# EAGLE design CircuitPlayground-BLE-V1 (EAGLE 9.3.2)
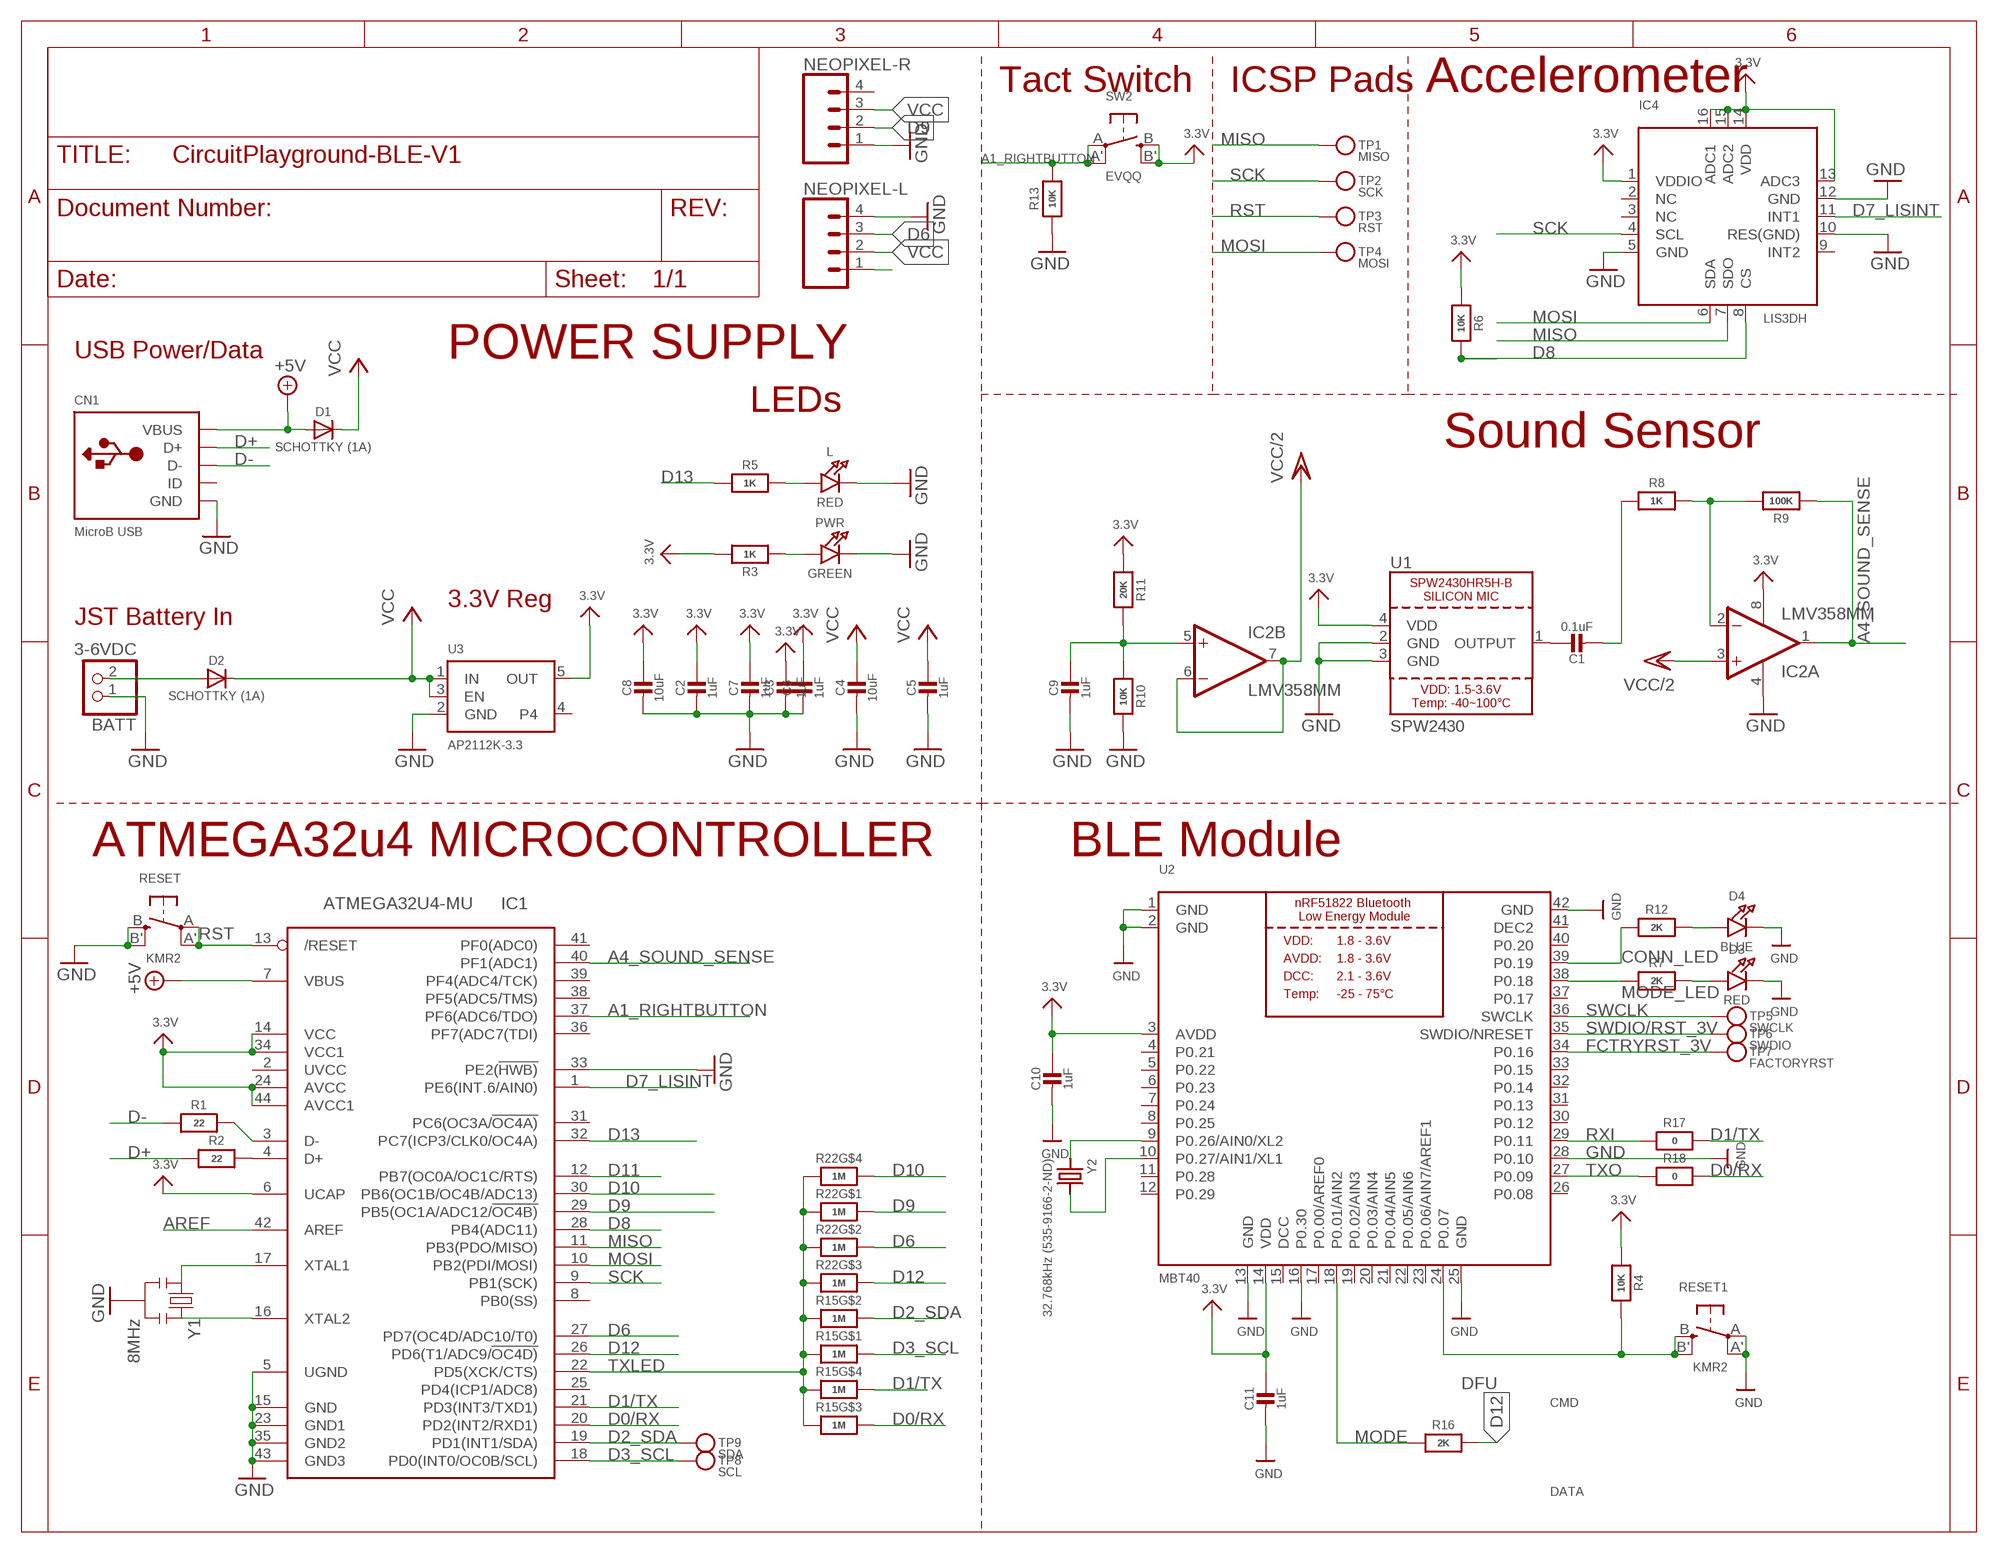
[diagram p0: schematic, sheet 1]

## Parts
BATT  3-6VDC  CON_JST_PH_2PIN  [JSTPH2]
C1  0.1uF  CAP_CERAMIC0603_NO  [0603-NO]
C2  1uF  CAP_CERAMIC0603_NO  [0603-NO]
C3  1uF  CAP_CERAMIC0603_NO  [0603-NO]
C4  10uF  CAP_CERAMIC0805-NOOUTLINE  [0805-NO]
C5  1uF  CAP_CERAMIC0603_NO  [0603-NO]
C6  1uF  CAP_CERAMIC0603_NO  [0603-NO]
C7  1uF  CAP_CERAMIC0603_NO  [0603-NO]
C8  10uF  CAP_CERAMIC0805-NOOUTLINE  [0805-NO]
C9  1uF  CAP_CERAMIC0603_NO  [0603-NO]
C10  1uF  CAP_CERAMIC0805-NOOUTLINE  [0805-NO]
C11  1uF  CAP_CERAMIC0805-NOOUTLINE  [0805-NO]
CN1  MicroB USB  USB_MICRO_20329_V2  [4UCONN_20329_V2]
D1  SCHOTTKY (1A)  DIODESOD-123  [SOD-123]
D2  SCHOTTKY (1A)  DIODESOD-123  [SOD-123]
D3  RED  LED0805_NOOUTLINE  [CHIPLED_0805_NOOUTLINE]
D4  BLUE  LED0805_NOOUTLINE  [CHIPLED_0805_NOOUTLINE]
IC1  ATMEGA32U4-MU  [TQFN44_7MM]
IC2  LMV358MM  [MSOP08]
IC4  LIS3DH  ACCEL_LIS3DHTR  [LGA16_3X3MM]
L  RED  LED0805_NOOUTLINE  [CHIPLED_0805_NOOUTLINE]
NEOPIXEL-L  CONN_04  [1X04]
NEOPIXEL-R  CONN_04  [1X04]
PWR  GREEN  LED0805_NOOUTLINE  [CHIPLED_0805_NOOUTLINE]
R1  22  RESISTOR_0603_NOOUT  [0603-NO]
R2  22  RESISTOR_0603_NOOUT  [0603-NO]
R3  1K  RESISTOR_0603_NOOUT  [0603-NO]
R4  10K  RESISTOR0805_NOOUTLINE  [0805-NO]
R5  1K  RESISTOR_0603_NOOUT  [0603-NO]
R6  10K  RESISTOR_0603_NOOUT  [0603-NO]
R7  2K  RESISTOR0805_NOOUTLINE  [0805-NO]
R8  1K  RESISTOR_0603_NOOUT  [0603-NO]
R9  100K  RESISTOR_0603_NOOUT  [0603-NO]
R10  10K  RESISTOR_0603_NOOUT  [0603-NO]
R11  20K  RESISTOR_0603_NOOUT  [0603-NO]
R12  2K  RESISTOR0805_NOOUTLINE  [0805-NO]
R13  10K  RESISTOR_0603_NOOUT  [0603-NO]
R15  1M  RESISTOR_4PACK_NO  [RESPACK_4X0603_NO]
R16  2K  RESISTOR0805_NOOUTLINE  [0805-NO]
R17  0  RESISTOR_0603_NOOUT  [0603-NO]
R18  0  RESISTOR_0603_NOOUT  [0603-NO]
R22  1M  RESISTOR_4PACK_NO  [RESPACK_4X0603_NO]
RESET  KMR2  SWITCH_TACT_SMT4.6X2.8  [BTN_KMR2_4.6X2.8]
RESET1  KMR2  SWITCH_TACT_SMT4.6X2.8  [BTN_KMR2_4.6X2.8]
SW2  EVQQ  SWITCH_TACT_SMT_EVQQ2_SMALL  [EVQ-Q2_SMALLER]
TP1  MISO  TESTPOINTROUND1.5MM  [TESTPOINT_ROUND_1.5MM]
TP2  SCK  TESTPOINTROUND1.5MM  [TESTPOINT_ROUND_1.5MM]
TP3  RST  TESTPOINTROUND1.5MM  [TESTPOINT_ROUND_1.5MM]
TP4  MOSI  TESTPOINTROUND1.5MM  [TESTPOINT_ROUND_1.5MM]
TP5  SWCLK  TESTPOINTROUND1.5MM  [TESTPOINT_ROUND_1.5MM]
TP6  SWDIO  TESTPOINTROUND1.5MM  [TESTPOINT_ROUND_1.5MM]
TP7  FACTORYRST  TESTPOINTROUND1.5MM  [TESTPOINT_ROUND_1.5MM]
TP8  SCL  TESTPOINTROUND1.5MM  [TESTPOINT_ROUND_1.5MM]
TP9  SDA  TESTPOINTROUND1.5MM  [TESTPOINT_ROUND_1.5MM]
U1  SPW2430  SPW2430HR5H-B  [SPW2430HR5H-B]
U2  MBT40  NRF51822_MODULE_MDBT40  [BLE_MODULE_RAYTAC_MDBT40]
U3  AP2112K-3.3  VREG_SOT23-5  [SOT23-5]
Y1  8MHz  RESONATORSMD  [RESONATOR-SMD]
Y2  32.768kHz (535-9166-2-ND)  CRYSTAL2.0X6.0_32.768  [CRYSTAL_CYL_2X6MM_SMT]

## Nets
3.3V: C2.1 C3.1 C6.1 C7.1 C8.1 C10.1 C11.1 IC1.6(UCAP) IC1.14(VCC) IC1.24(AVCC) IC1.34(VCC1) IC1.44(AVCC1) IC2.8(P:V+) IC4.1(VDDIO) IC4.13(ADC3) IC4.14(VDD) IC4.15(ADC2) IC4.16(ADC1) NEOPIXEL-L.1 R3.2 R4.1 R6.1 R11.1 SW2.B'(S1) SW2.B(S) U1.4(VDD) U2.3(AVDD) U2.14(VDD) U3.5(OUT)
+5V: CN1.VBUS D1.A IC1.7(VBUS)
A1_RIGHTBUTTON: IC1.37(PF6(ADC6/TDO)) R13.2 SW2.A'(P1) SW2.A(P)
A4_SOUND_SENSE: IC1.40(PF1(ADC1)) IC2.1(A:OUT) R9.1
AREF: IC1.42(AREF)
CONN_LED: R12.1 U2.39(P0.19)
D0/RX: IC1.20(PD2(INT2/RXD1)) R15.6 R18.2
D1/TX: IC1.21(PD3(INT3/TXD1)) R15.5 R17.2
D2_SDA: IC1.19(PD1(INT1/SDA)) R15.7 TP9.P$1
D3_SCL: IC1.18(PD0(INT0/OC0B/SCL)) R15.8 TP8.P$1
D6: IC1.27(PD7(OC4D/ADC10/T0)) NEOPIXEL-L.3 R22.7
D7_LISINT: IC1.1(PE6(INT.6/AIN0)) IC4.11(INT1)
D8: IC1.28(PB4(ADC11)) IC4.8(CS) R6.2
D9: IC1.29(PB5(OC1A/ADC12/!OC4B)) NEOPIXEL-R.2 R22.8
D10: IC1.30(PB6(OC1B/OC4B/ADC13)) R22.5
D11: IC1.12(PB7(OC0A/OC1C/RTS))
D12: IC1.26(PD6(T1/ADC9/!OC4D)) R16.2 R22.6
D13: IC1.32(PC7(ICP3/CLK0/OC4A)) R5.1
D+: CN1.D+ R2.1
D-: CN1.D- R1.1
DFU: R4.2 RESET1.B'(S1) RESET1.B(S) U2.24(P0.07)
FCTRYRST_3V: TP7.P$1 U2.34(P0.16)
GND: BATT.1 C2.2 C3.2 C4.2 C5.2 C6.2 C7.2 C8.2 C9.2 C10.2 C11.2 CN1.BASE@1(GND) CN1.BASE@2(GND) CN1.GND CN1.SPRT@1(GND) CN1.SPRT@2(GND) CN1.SPRT@3(GND) CN1.SPRT@4(GND) D3.C D4.C IC1.5(UGND) IC1.15(GND) IC1.23(GND1) IC1.33(PE2(!HWB)) IC1.35(GND2) IC1.43(GND3) IC2.4(P:V-) IC4.5(GND) IC4.10(RES(GND)) IC4.12(GND) L.C NEOPIXEL-L.4 NEOPIXEL-R.1 PWR.C R10.2 R13.1 RESET1.A'(P1) RESET1.A(P) RESET.B'(S1) RESET.B(S) U1.2(GND) U1.3(GND) U2.1(GND) U2.2(GND) U2.13(GND) U2.16(P0.30) U2.25(GND) U2.28(P0.10) U2.42(GND) U3.2(GND) Y1.2
MISO: IC1.11(PB3(PDO/MISO)) IC4.7(SDO) TP1.P$1
MODE: R16.1 U2.18(P0.01/AIN2)
MODE_LED: R7.1 U2.38(P0.18)
MOSI: IC1.10(PB2(PDI/MOSI)) IC4.6(SDA) TP4.P$1
N$1: PWR.A R3.1
N$2: IC2.2(A:-IN) R8.2 R9.2
N$3: IC1.3(D-) R1.2
N$4: IC1.4(D+) R2.2
N$5: D3.A R7.2
N$6: C9.1 IC2.5(B:+IN) R10.1 R11.2
N$7: BATT.2 D2.A
N$8: IC1.17(XTAL1) Y1.1
N$9: IC1.16(XTAL2) Y1.3
N$10: L.A R5.2
N$11: D4.A R12.2
N$12: U2.9(P0.26/AIN0/XL2) Y2.1
N$13: U2.10(P0.27/AIN1/XL1) Y2.2
N$15: C1.2 R8.1
RST: IC1.13(/RESET) RESET.A'(P1) RESET.A(P) TP3.P$1
RXI: R17.1 U2.29(P0.11)
SCK: IC1.9(PB1(SCK)) IC4.4(SCL) TP2.P$1
SOUNDOUT: C1.1 U1.1(OUTPUT)
SWCLK: TP5.P$1 U2.36(SWCLK)
SWDIO/RST_3V: TP6.P$1 U2.35(SWDIO/NRESET)
TXLED: IC1.22(PD5(XCK/CTS)) R15.1 R15.2 R15.3 R15.4 R22.1 R22.2 R22.3 R22.4
TXO: R18.1 U2.27(P0.09)
VCC: C4.1 C5.1 D1.C D2.C NEOPIXEL-L.2 NEOPIXEL-R.3 U3.1(IN) U3.3(EN)
VCC/2: IC2.3(A:+IN) IC2.6(B:-IN) IC2.7(B:OUT)
Unconnected: CN1.ID IC1.2(UVCC) IC1.8(PB0(SS)) IC1.25(PD4(ICP1/ADC8)) IC1.31(PC6(OC3A/!OC4A)) IC1.36(PF7(ADC7(TDI)) IC1.38(PF5(ADC5/TMS)) IC1.39(PF4(ADC4/TCK)) IC1.41(PF0(ADC0)) IC4.2(NC) IC4.3(NC) IC4.9(INT2) NEOPIXEL-R.4 U2.4(P0.21) U2.5(P0.22) U2.6(P0.23) U2.7(P0.24) U2.8(P0.25) U2.11(P0.28) U2.12(P0.29) U2.17(P0.00/AREF0) U2.19(P0.02/AIN3) U2.20(P0.03/AIN4) U2.21(P0.04/AIN5) U2.22(P0.05/AIN6) U2.23(P0.06/AIN7/AREF1) U2.26(P0.08) U2.30(P0.12) U2.31(P0.13) U2.32(P0.14) U2.33(P0.15) U2.37(P0.17) U2.40(P0.20) U3.4

## Notes on the sheet
- Tact Switch | ICSP Pads | Accelerometer
- USB Power/Data | POWER SUPPLY
- LEDs
- Sound Sensor
- 3.3V Reg
- JST Battery In
- ATMEGA32u4 MICROCONTROLLER | BLE Module
- CMD
- DATA

## Power pins joined to a net without a drawn wire
DCC: U2.15(DCC)
DEC2: U2.41(DEC2)

## Library data of the parts
BATT = microbuilder:CON_JST_PH_2PIN: JST 2-Pin Right-Angle Connector PH-Series - 4UConnector: 17311 SH-Series - 4UConnector: 07278
C1-C11 = microbuilder:CAP_CERAMIC: Ceramic Capacitors For new designs, use the packages preceded by an '_' character since they are more reliable: The following footprints should be used on most boards: _0402 - Standard footprint for regular board layouts _0603 - Standard footprint for regular board layouts _0805 - Standard footprint for regular board layouts _1206 - Standard footprint for regular board layouts For extremely tight-pitch boards where space is at a premium, the following 'micro-pitch' footprints can be used (smaller pads, no silkscreen outline, etc.): _0402MP - Micro-pitch footprint for very dense/compact boards _0603MP - Micro-pitch footprint for very dense/compact boards _0805MP - Micro-pitch footprint for very dense/compact boards _1206MP - Micro-pitch footprint for very dense/compact boards
CN1 = microbuilder:USB: USB Connectors USBMINIB - Surface Mount Female Mini-B USB Connector 4UConnector: 06564
D1 D2 = microbuilder:DIODE: Diode SMA Model Volts Amps Type Vf Ir Digikey # Notes SSA34-E3 40V 3A Schottky 480mV @ 3A 200uA @ 40V SSA34-E3/61TGITR-ND CDBA120-G 20V 1A Schottky 500mV @ 1A 500uA @ 20V 641-1014-6-ND REEL MBRA210 10V 2A Schottky 350mV @ 2A 700uA @ 10V MBRA210LT3 SOD-123 Model Volts Amps Type Vf Ir Order # Notes BAT54T1G 30V 200mA Schottky 800mV @ 200mA 2uA @ 25V BAT54T1GOSTR-ND B0530W 30V 500mA Schottky 430mV @ 500mA 130uA @ 30V B0530W-FDICT-ND REEL MBR120 20V 1A Schottky 340mV @ 1A MBR120VLSFT1GOSCT-ND SOD-323 Model Volts Amps Type Vf Ir Order # Notes PMEG2005EJ 20V 500mA Schottky 355mV @ 500mA 568-4110-1-ND ZLLS410 10V 570mA Schottky 380mV @ 570mA ZLLS410CT-ND 1N4148WS 75V 150mA Silicon/Simple 1V 1N4148WSFSCT-ND REEL SOD-523 Model Volts Amps Type Vf Ir Order # Notes BAT54XV2 30V 200mA Schottky 0.8V @ 100mA BAT54XV2CT-ND TB751S 30V 30mA Schottky RB751S-40TE61CT-ND SOT23-R/W (R = Solder Paste/Reflow Ovens, W = Hand-Soldering) Model Volts Amps Type Vf Ir Order # Notes BAT54FILM 40V 300mA Schottky 497-7162-1-ND POWERDI-5 Model Volts Amps Type Vf Ir Order # Notes PDS560 60V 5A Schottky 670mV @ 5A 150uA @ 60V PDS560DICT-ND
D3 D4 L PWR = microbuilder:LED: LED 0603 - 0603 Surface Mount Package 2mA: Green LED - Low Power (3.9mcd, 2ma, 1.7Vf) - Digikey: 475-2709-2-ND Orange LED - Low Power (9.8mcd, 2ma, 1.8Vf) - Digikey: 475-1194-2-ND Red LED - Low Power (5mcd, 2ma, 1.8Vf) - Digikey: 475-1195-2-ND Yellow LED - Low Power (7mcd, 2ma, 1.8Vf) - Digikey: 475-1196-2-ND 5mA: Blue LED - Low Power (17mcd, 5ma, 2.9Vf) - Digikey: LNJ937W8CRACT-ND 0805 - 0805 Surface Mount Package 2mA: Red LED (8.8mcd, 2mA, 1.8Vf, Clear) - Low Power [Digikey: 475-2510-1-ND] Green LED (5mcd, 2mA, 1.8Vf, Clear) - Low Power [Digikey: 475-2730-1-ND] Yellow LED (11.3mcd, 2mA, 1.8Vf, Clear) - Low Power [Digikey: 475-2555-1-ND] 20mA: Red LED (104mcd, 20mA, Diffused) - LS R976 [Digikey: 475-1278-6-ND] Red LED (12mcd, 20mA, 2.0Vf, Clear) - APT2012EC [Digikey: 754-1128-1-ND] Green LED (15mcd, 20mA, 2.2Vf, Clear) - APT2012GC [Digikey: 754-1131-1-ND] Orange LED (160mcd, 20mA, 2.1Vf, Clear) - APT2012SECK [Digikey: 754-1130-1-ND] 1206 - 1206 Surface Mount Package Green LED (26mcd, 20mA, Diffused) - LG N971 [Digikey: 475-1407-6-ND] Red LED (15mcd, 20mA, Diffused) - LH N974 [Digikey: 475-1416-6-ND] Cree - Cree High-Power Surface Mount LEDs XPEBWT-L1-0000-00D50 - White 111lm 350mA 2.9Vf 6200K 110° XTEAWT-00-0000-00000LEE3 - White 114lm 350mA 2.85Vf 5000K 115° Everlight - Everlight 45-21 Series Surface Mount LEDs 45-21/QK2C-B2832AC2CB2/2T - Warm White 2000mcd 20mA 3.25Vf 3050K 120° 45-21/LK2C-B38452C4CB2/2T - Nuetral White 2000mcd 20mA 3.25Vf 4150K 120° 45-21/LK2C-B50634C6CB2/2T - Cold White 2200mcd 20mA 3.25Vf 5650K 120° PLCC2 Reverse Mount LS T77K-J1L2-1-0-2-R18-Z - Red 11.25mcd 2mA 1.8Vf 630nm 120° LO T77K-L1M2-24-Z - Orange 19.6mcd 2mA 1.8Vf 606nm 120° LY T77K-K2M1-26-Z - Yellow 15.7mcd 2mA 1.8Vf 587nm 120°
IC1 = microbuilder:ATMEGA32U4: http://www.ladyada.net/library/eagle
IC2 = linear:LMV358?*: Dual General Purpose, Low Voltage, Rail-to-Rail Output Operational Amplifiers Source: http://www.national.com/mpf/LM/LMV321.html http://www.national.com/dt/lmv_qual.pdf
IC4 = microbuilder:ACCEL_LIS3DHTR: LIS3DHTR 3-Axis Accelerometer with I2C/SPI Interface VDD: 1.71-3.6V VDDIO: 1.71-VDD+0.1V Scale: +/-2g, 4g, 8g, 16g with 16--bit data output Temp:: -40°C - 85°C Mouser: 511-LIS3DHTR Digikey: 497-10613-1-ND
NEOPIXEL-L NEOPIXEL-R = SparkFun-Connectors:CONN_04: Multi connection point. Often used as Generic Header-pin footprint for 0.1 inch spaced/style header connections On any of the 0.1 inch spaced packages, you can populate with these: Break Away Headers - Straight <https://www.sparkfun.com/products/116> (PRT-00116) Break Away Male Headers - Right Angle <https://www.sparkfun.com/products/553> (PRT-00553) Female Headers <https://www.sparkfun.com/products/115> (PRT-00115) Break Away Headers - Machine Pin <https://www.sparkfun.com/products/117> (PRT-00117) Break Away Female Headers - Swiss Machine Pin <https://www.sparkfun.com/products/743> (PRT-00743) For SCREWTERMINALS and SPRING TERMINALS visit here: Screw Terimnals on SparkFun.com <https://www.sparkfun.com/search/results?term=Screw+Terminals> (5mm/3.5mm/2.54mm spacing) This device is also useful as a general connection point to wire up your design to another part of your project. Our various solder wires solder well into these plated through hole pads. Hook-Up Wire - Assortment (Stranded, 22 AWG) <https://www.sparkfun.com/products/11375> (PRT-11375) Hook-Up Wire - Assortment (Solid Core, 22 AWG) <https://www.sparkfun.com/products/11367> (PRT-11367) View the entire wire category on our website here <https://www.sparkfun.com/categories/141> Special notes: Molex polarized connector foot print use with SKU : PRT-08231 with associated crimp pins and housings. 1MM SMD Version SKU: PRT-10208; PROD_ID: CONN-09696
R1-R13 R16-R18 = microbuilder:RESISTOR: Resistors For new designs, use the packages preceded by an '_' character since they are more reliable: The following footprints should be used on most boards: _0402 - Standard footprint for regular board layouts _0603 - Standard footprint for regular board layouts _0805 - Standard footprint for regular board layouts _1206 - Standard footprint for regular board layouts For extremely tight-pitch boards where space is at a premium, the following 'micro-pitch' footprints can be used (smaller pads, no silkscreen outline, etc.): _0402MP - Micro-pitch footprint for very dense/compact boards _0603MP - Micro-pitch footprint for very dense/compact boards _0805MP - Micro-pitch footprint for very dense/compact boards _1206MP - Micro-pitch footprint for very dense/compact boards
R15 R22 = microbuilder:RESISTOR_4PACK: Resistor Packs (4 resistors) 4 x 0603 10K 1/16W - Digikey: YC164J-10KCT-ND
RESET RESET1 SW2 = microbuilder:SWITCH_TACT_SMT: SMT Tact Switches 6x6mm - Digikey: P12940SCT-ND KMR2 (4.6x2.8mm) - Digikey: 401-1426-1-ND EVQ-PQHB55 - Light Touch, 160GF (4.5x4.5mm) - Digikey: P8090SCT-ND KMT0 - KMT021 NGJ LHS (etc.) IP68/Waterproof - Digikey: CKN10289CT-ND
TP1-TP9 = microbuilder:TESTPOINT: Test Point Various test points for characterisation and PCB testing TESTPOINT_SMT - Compact Surface Mount Test Point [Digikey: 5016KTR-ND]
U1 = microbuilder:SPW2430HR5H-B: SPW2430HR5H-B - Silicon Microphone
U2 = microbuilder:NRF51822_MODULE_MDBT40: nRF51822 Bluetooth Low Energy Module
U3 = microbuilder:VREG_SOT23-5: SOT23-5 Fixed Voltage Regulators Part Current Out V Out V In V Dropout θJA (°C/W) TJ (°C) Digikey Part No. ADP121 150mA 3.3V 3.4-5.5V 0.09V @ 150mA -- -- ADP121-AUJZ33R7CT-ND ADP121 150mA 3.0V 3.1-5.5V 0.09V @ 150mA -- -- ADP121-AUJZ30R7CT-ND ADP122 300mA 3.3V 3.4-5.5V 0.085V @ 300mA -- -- ADP122AUJZ-3.3-R7CT-ND ADP1712 300mA 3.3V 3.5-5.5V 0.17V @ 300mA -- -- ADP1712AUJZ-3.3-R7TR-ND AP7311 (Low Cost) 150mA 3.3V 3.5-6V 0.15V @ 150mA -- -- AP7311-33WG-7DICT-ND LD39015M18R 150mA 1.8V 1.9V-5.5V 0.08V @ 100mA -- -- 497-6977-1-ND LP2985A-33DBVR 150mA 3.3V 3.3-16V 0.28V @ 150mA 206 150 296-18479-1-ND MCP1824T-3302E/OT 300mA 3.3V 3.5V-6V 0.2V @ 300mA -- -- MCP1824T-3302E/OTCT-ND MIC5205-2.5YM5 TR 150mA 2.5V 2.7-16V 0.165V @ 150mA -- -- 576-1257-2-ND MIC5205-3.0YM5 TR 150mA 3.0V 3.2V-16V 0.165V @ 150mA -- -- 576-1258-2-ND MIC5205-3.3YM5 TR 150mA 3.3V 3.5V-16V 0.165V @ 150mA -- -- 576-1259-2-ND TPS780330220 150mA 3.3V+2.2V 3.6-5.5V 250mV Max -- -- 296-23332-1-ND TDA3663/N1,135 100mA 3.3V 3.5-45V 0.18V @ 50mA -- -- 568-5343-1-ND Max operating temp can be calculated using θJA, TJ (max junction temperature), and power in watts. Set the "Maximum Ambient Temperature" until it reaches TJ ("Max Junction Temperature"), which is the absolute limit for safe use of the regulator: Heat Sink Temperature Calculator <http://www.daycounter.com/Calculators/Heat-Sink-Temperature-Calculator.phtml> For example, With 12V source into a 3.3V LP2985 and a 30mA load, we are dissipating (12V-3.3V) * 0.03A = 0.261W. With a θJA of 206 °C/W, a TJ of 150°C, and 261mW we can safely use the chip without a heat sink up to 75°C (=147.1°C Junction Temperature).
Y1 = SparkFun:RESONATOR: Resonator Small SMD resonator. This is the itty bitty 10/20MHz resonators with built in caps. CSTCE10M0G55 and CSTCE20M0V53. Footprint has been reviewed closely but hasn't been tested yet.
Y2 = microbuilder:CRYSTAL: Crystals HC49UP - Surface Mount Crystal 4.0MHz 18pF +/-30ppm Surface Mount Crystal [Digikey: 535-9857-1-ND] 12.0 MHz Surface Mount Crystal [Digikey: 535-9869-6-ND] 25.0 MHz Surface Mount Crystal [Digikey: 535-9078-1-ND] 2.5 x 2.0mm - MEMs SMT Crystal 16.0 MHz 10pF 20ppm 2.5 x 2.0mm Crystal [Digikey -40-85°C: 535-10923-1-ND] 3.2 x 2.5mm - MEMs SMT Crystal 12.0 MHz 8pF 15ppm 3.2 x 2.5mm Crystal [Digikey: -10-70°C: 644-1047-1-ND -40-125°C: 644-1128-1-ND] 40~85°C cheaper: 644-1173-6-ND 16.0 MHz 8pF 15ppm 3.2 x 2.5mm Crystal [Digikey: -10-70°C: 644-1049-1-ND -40-125°C: 644-1129-2-ND]-40~85°C cheaper: 644-1175-6-ND 16.0 MHz 10pF 10ppm 3.2 x 2.5mm Crystal [Digikey: 644-1100-1-ND] 27.12 MHz 18pF 30ppm 3.2 x 2.5mm Crystal [Digikey: 887-1424-1-ND] 27.12MHz 10pF 10ppm 3.2 x 2.5mm Crystal [Digikey: 887-1329-1-ND] 4.9 x 1.8mm - MEMs SMT Crystal 32.768 KHz 12.5pF 20ppm 4.9 x 1.8mm Crystal [Digikey: SE2415CT-ND] 8.0 x 3.8mm - Surface Mount Crystal 32.768kHz 12.5pF 20ppm -40°C-85°C [Digikey: 535-9166-2-ND] Cylinder 32.768KHz Cylinder Crystal (2x6mm body) [Ex. Digikey: 300-8341-2-ND]

## Board
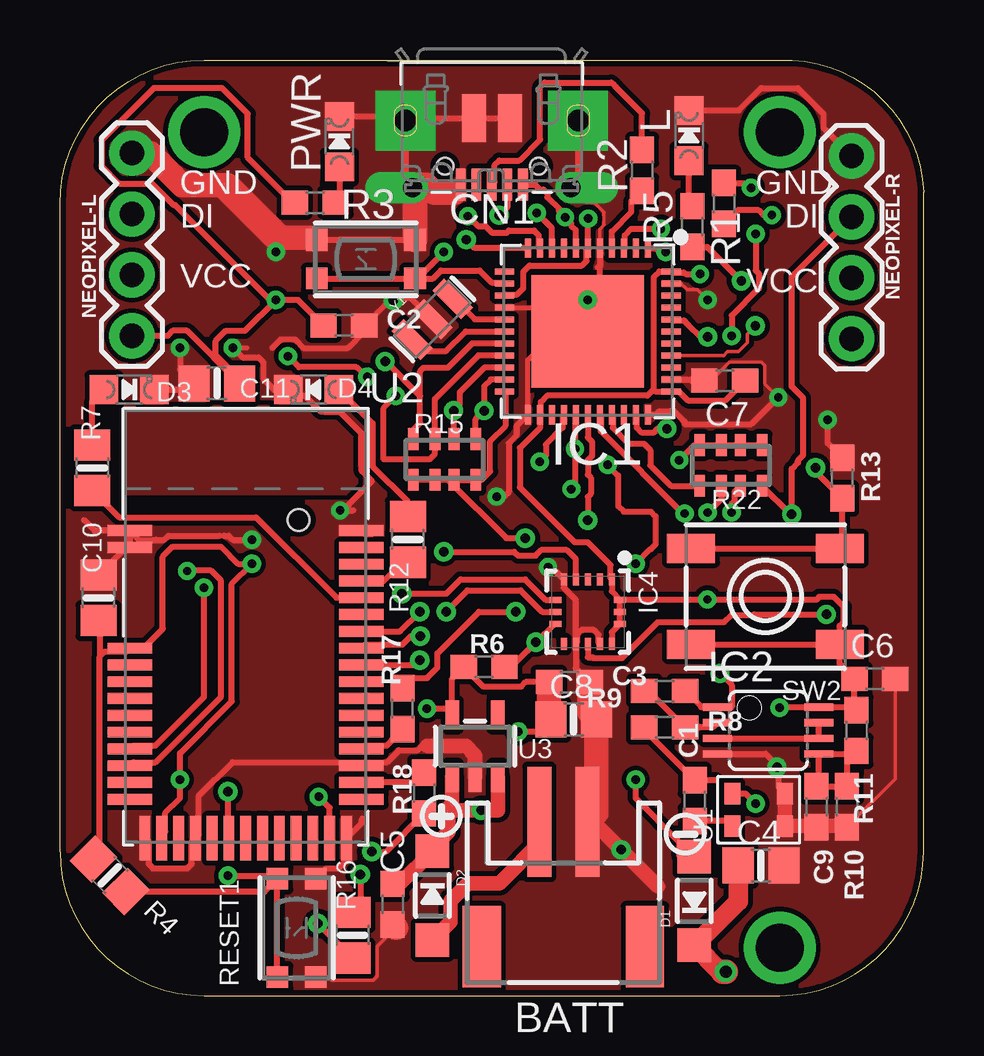
[diagram p1: board, top side]
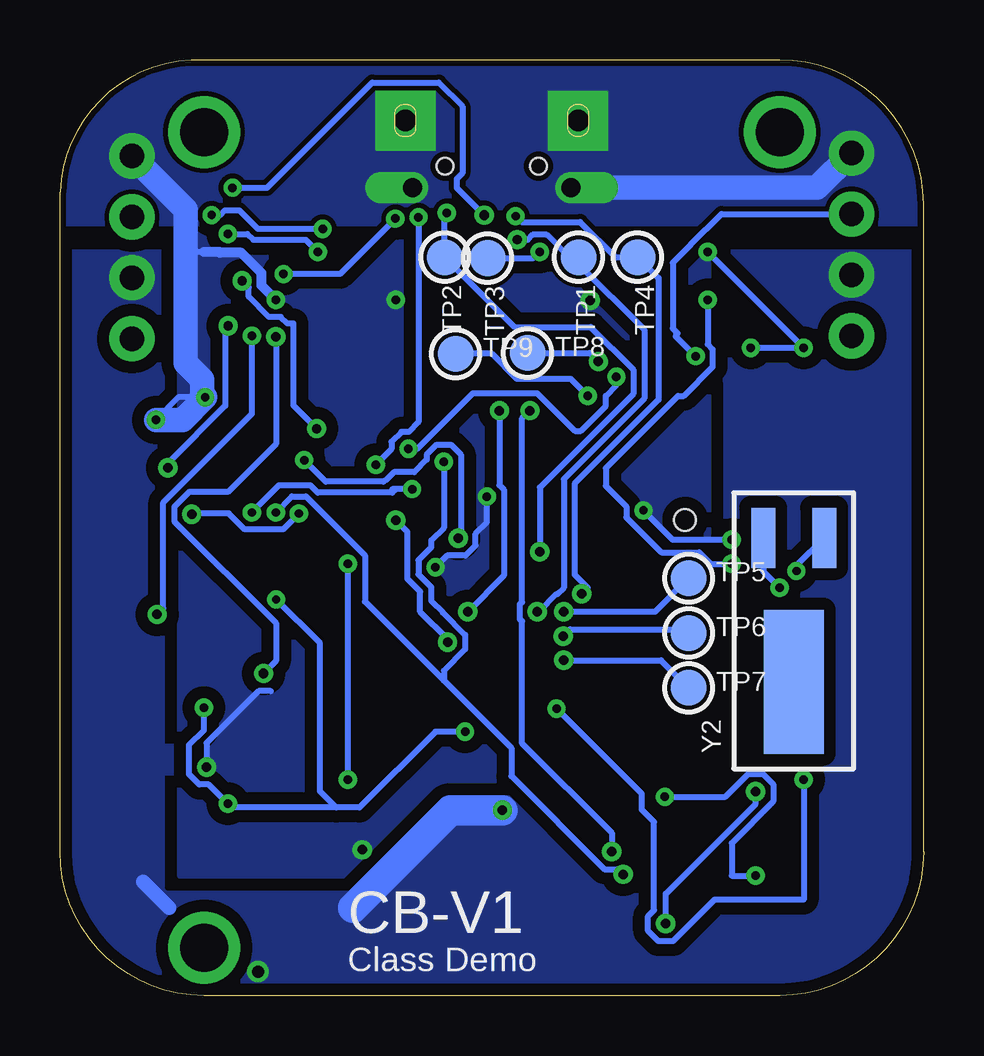
[diagram p2: board, bottom side, seen from below]

Size 36 x 39 mm. Coordinates in mm from the lower left corner, seen from the top.
Outline: 6,39 30,39 arc-90 36,33.5 36,6 arc-90 30,0 6,0 arc-90 0,6 0,33 arc-90 6,39
Copper layers (1*16): Top 0.035mm / dielectric 1.5mm / Bottom 0.035mm
Design rules "adafruit *": minimum track width 0.15mm, minimum drill 0.35mm, track to track 8mil, track to pad 8mil, pad to pad 8mil, via to via 8mil, smd to smd 8mil, copper to edge 10mil, drill to drill 8mil, minimum pad ring 10mil, minimum via ring 8mil, stop-mask expansion 2mil, vias tented up to drill 20mil, thermal gap 10mil

### Footprints (pad centres in the part's own frame; a part is rotated, then mirrored left to right if it is on the bottom)
JSTPH2 = smd 1 x 4.6: 1 -1,-3.7; 2 1,-3.7 | smd 1.6 x 3.4: NC1 -3.4,1.5; NC2 3.4,1.5
0603-NO = smd 1.1 x 1: 1 -0.85,0; 2 0.85,0
0805-NO = smd 1.3 x 1.5: 1 -0.95,0; 2 0.95,0
4UCONN_20329_V2 = smd 1 x 2: BASE@1 -0.75,-2; BASE@2 0.75,-2 | smd 0.4 x 1.35: D+ 0,0.775; D- -0.65,0.775; GND 1.3,0.775; ID 0.65,0.775; VBUS -1.3,0.775 | drill 0.8 pad 1.2 offset: SPRT@1 -3.3,0.9; SPRT@2 3.3,0.9 | drill 0.9 pad 2.5 square: SPRT@3 -3.6,-1.9; SPRT@4 3.6,-1.9 | hole 0.7: -1.95,0; 1.95,0
SOD-123 = smd 1.4 x 1.4: A 1.85,0; C -1.85,0
CHIPLED_0805_NOOUTLINE = smd 1.2 x 1.2: A 0,-1.05; C 0,1.05
TQFN44_7MM = smd 0.25 x 0.8: 1 -2.5,-3.475; 2 -2,-3.475; 3 -1.5,-3.475; 4 -1,-3.475; 5 -0.5,-3.475; 6 0,-3.475; 7 0.5,-3.475; 8 1,-3.475; 9 1.5,-3.475; 10 2,-3.475; 11 2.5,-3.475; 23 2.5,3.475; 24 2,3.475; 25 1.5,3.475; 26 1,3.475; 27 0.5,3.475; 28 0,3.475; 29 -0.5,3.475; 30 -1,3.475; 31 -1.5,3.475; 32 -2,3.475; 33 -2.5,3.475 | smd 0.8 x 0.25: 12 3.475,-2.5; 13 3.475,-2; 14 3.475,-1.5; 15 3.475,-1; 16 3.475,-0.5; 17 3.475,0; 18 3.475,0.5; 19 3.475,1; 20 3.475,1.5; 21 3.475,2; 22 3.475,2.5; 34 -3.475,2.5; 35 -3.475,2; 36 -3.475,1.5; 37 -3.475,1; 38 -3.475,0.5; 39 -3.475,0; 40 -3.475,-0.5; 41 -3.475,-1; 42 -3.475,-1.5; 43 -3.475,-2; 44 -3.475,-2.5 | smd 4.7 x 4.7: THERMAL 0,0
MSOP08 = smd 0.3 x 1.2: 1 -0.976,-2.113; 2 -0.326,-2.113; 3 0.324,-2.113; 4 0.974,-2.113; 5 0.974,2.112; 6 0.324,2.112; 7 -0.326,2.112; 8 -0.976,2.112
LGA16_3X3MM = smd 0.5 x 0.25: 1 -1.35,1; 2 -1.35,0.5; 3 -1.35,0; 4 -1.35,-0.5; 5 -1.35,-1; 9 1.35,-1; 10 1.35,-0.5; 11 1.35,0; 12 1.35,0.5; 13 1.35,1 | smd 0.25 x 0.5: 6 -0.5,-1.35; 7 0,-1.35; 8 0.5,-1.35; 14 0.5,1.35; 15 0,1.35; 16 -0.5,1.35
1X04 = drill 1.016 pad 1.88: 1 0,0; 2 2.54,0; 3 5.08,0; 4 7.62,0
RESPACK_4X0603_NO = smd 0.45 x 0.9: 1 -1.3,-0.85; 2 -0.4,-0.85; 3 0.4,-0.85; 4 1.3,-0.85; 5 1.3,0.85; 6 0.4,0.85; 7 -0.4,0.85; 8 -1.3,0.85
BTN_KMR2_4.6X2.8 = smd 0.9 x 0.9: A 2.05,0.8; A' -2.05,0.8; B 2.05,-0.8; B' -2.05,-0.8
EVQ-Q2_SMALLER = smd 2 x 1.2: A -3.1,-2; A' 3.1,-2; B -3.1,2; B' 3.1,2
TESTPOINT_ROUND_1.5MM = smd 1.5 x 1.5: P$1 0,0
SPW2430HR5H-B = smd 0.9 x 0.66: 1 -0.675,1.095; 2 -0.675,-1.095; 3 0.675,-1.095; 4 0.675,1.095
BLE_MODULE_RAYTAC_MDBT40 = smd 1.85 x 0.45: 1 -4.825,4; 2 -4.825,3.3; 3 -4.825,-0.9; 4 -4.825,-1.6; 5 -4.825,-2.3; 6 -4.825,-3; 7 -4.825,-3.7; 8 -4.825,-4.4; 9 -4.825,-5.1; 10 -4.825,-5.8; 11 -4.825,-6.5; 12 -4.825,-7.2; 26 4.825,-7.2; 27 4.825,-6.5; 28 4.825,-5.8; 29 4.825,-5.1; 30 4.825,-4.4; 31 4.825,-3.7; 32 4.825,-3; 33 4.825,-2.3; 34 4.825,-1.6; 35 4.825,-0.9; 36 4.825,-0.2; 37 4.825,0.5; 38 4.825,1.2; 39 4.825,1.9; 40 4.825,2.6; 41 4.825,3.3; 42 4.825,4 | smd 0.45 x 1.85: 13 -4.2,-8.825; 14 -3.5,-8.825; 15 -2.8,-8.825; 16 -2.1,-8.825; 17 -1.4,-8.825; 18 -0.7,-8.825; 19 0,-8.825; 20 0.7,-8.825; 21 1.4,-8.825; 22 2.1,-8.825; 23 2.8,-8.825; 24 3.5,-8.825; 25 4.2,-8.825 | hole 0.9: 2.2,4.45
SOT23-5 = smd 0.55 x 1.2: 1 -0.95,-1.3; 2 0,-1.3; 3 0.95,-1.3; 4 0.95,1.3; 5 -0.95,1.3
RESONATOR-SMD = smd 0.7 x 1.7: 1 -1.2,0; 2 0,0; 3 1.2,0
CRYSTAL_CYL_2X6MM_SMT = smd 2.5 x 1: 1 2.125,1.27; 2 2.125,-1.27 | smd 6 x 2.5: CYLINDER -3.875,0

### Placement (x,y rotation side)
BATT  20.98,3.54 180 top
C1  26.46,8.13 90 top
C2  11.84,27.93 0 top
C3  21.24,13.06 0 top
C4  29.22,5.42 0 top
C5  13.87,3.81 270 top
C6  33.97,13.21 0 top
C7  27.71,25.64 180 top
C8  21.41,11.51 0 top
C9  31.54,7.87 270 top
C10  1.61,16.58 90 top
C11  6.54,25.52 180 top
CN1  18,34.58 180 top
D1  26.45,3.95 90 top
D2  15.52,4.17 270 top
D3  2.88,25.26 270 top
D4  10.57,25.26 90 top
IC1  22,27.68 180 top
IC2  29.52,11.05 270 top
IC4  22,16 270 top
L  26.22,35.85 0 top
NEOPIXEL-L  3,27.5 90 top
NEOPIXEL-R  33,35 270 top
PWR  11.65,35.59 0 top
R1  27.68,33.02 270 top
R2  24.27,34.4 270 top
R3  10.64,33.05 180 top
R4  2.08,5.02 315 top
R5  26.36,32.06 90 top
R6  17.68,13.7 0 top
R7  1.35,22 90 top
R8  25.21,11.17 0 top
R9  25.21,12.7 180 top
R10  32.81,7.87 270 top
R11  33.21,11.05 270 top
R12  14.5,19.02 90 top
R13  32.61,21.57 270 top
R15  16.03,22.35 0 top
R16  12.2,2.52 90 top
R17  14.27,11.96 90 top
R18  15.18,8.44 270 top
R22  27.97,22.1 180 top
RESET  12.75,30.69 180 top
RESET1  9.86,2.82 270 top
SW2  29.41,16.64 180 top
TP1  14.38,30.78 270 bottom
TP2  19.96,30.78 270 bottom
TP3  18.17,30.74 270 bottom
TP4  11.92,30.78 270 bottom
TP5  9.79,17.4 0 bottom
TP6  9.79,15.11 0 bottom
TP7  9.79,12.82 0 bottom
TP8  16.51,26.79 0 bottom
TP9  19.51,26.75 0 bottom
U1  29.13,7.74 90 top
U2  7.74,15.38 0 top
U3  17.3,10.4 0 top
U$1  [SYMBOL_MINUS]  26.06,6.73 0 top
U$35  [SYMBOL_PLUS]  15.9,7.47 0 top
U$46  [CPLAYBACK]  43.4,-7.4 0 bottom  (outside the outline)
Y1  15.52,28.19 45 top
Y2  5.41,16.95 90 bottom

### Tracks (layer width: path | path; a pad name or v marks a point on that pad's centre or on a via)
3.3V  (via drill 0.35)
  Top 0.254: 25.64,25.18 IC1.34 | IC4.16 23,16.85 IC4.1 22.95,17.39 22.95,17.94 22,18.89 21.46,18.89 19.17,21.18 19.17,22.83 19.18,22.83 20,23.65 IC1.24 20.05,24.25 20.05,24.75 20.3,25 24.49,25 24.75,25.26 | C3.1 19.41,13.06 19.22,12.87 17.66,12.87 R6.1 16.35,13.22 U3.5 16.09,11.96 v15.3,11.96 | 1.66,14.14 1.86,14.34 2.78,14.34 U2.3 3.48,14.48 4.29,15.29 4.29,18.29 4.71,18.71 6.71,18.71 7.42,18 v8,18 7.17,17.17 7.17,12.26 5,10.1 v5,9 5,8.23 4.39,7.62 4.39,6.84 4.18,6.63 U2.14 | 1.66,14.14 1.66,5.95 R4.1 | SW2.B' SW2.B | IC4.16 IC4.15 IC4.14 23,15.15 IC4.13 | IC1.14 18.57,29.23 19.06,29.23 19.32,29.49 19.32,30.17 19.58,30.43 21.76,30.43 21.95,30.62 21.95,31.11 IC1.6 22.02,31.18 v22.02,32.39 | C10.1 1.66,15.57 1.66,14.14 | 7.52,25.52 C11.1 | C11.1 8,26.02 | C2.1 9.92,29 v9,29 | NEOPIXEL-L.1 4.5,27.5 4.71,27.71 5.3,27.71 C11.1 | 9.79,33.21 R3.2 arc90 10,32.77 7.83,34.93 7.83,36.76 6.76,37.83 3.91,37.83 1.73,35.65 1.73,34.59 2.47,33.85 3.84,33.85 4.74,32.95 4.8,32.95 8.75,29 v9,29 | SW2.B 32.51,13.82 C6.1 33.12,11.98 R11.1 33.08,12.02 IC2.8 30.02,12.02 v30,12 | SW2.B 32.51,15.41 32.68,15.59 32.68,16.19 32.26,16.62 31.65,16.62 31.53,16.5 IC4.16 | C8.1 19.96,11 v19.11,11 | v9,29 7.71,27.71 6.91,27.71 6.49,27.29 6.49,26.71 7.49,25.71 C11.1 | U1.4 28.58,8.42 v29,8 | 24.75,25.26 24.75,29.95 24.98,30.18 IC1.44 25.52,30.14 26.01,30.14 26.07,30.08 v26.68,30.08 | 24.75,25.26 24.82,25.18 IC1.34 | IC1.34 25.8,25.18 26.18,24.81 27.73,24.81 C7.1
  Top 1.016: C3.1 20.39,11.58 C8.1
  Bottom 0.254: v5,9 5,4 8.71,4 10.45,2.27 11.05,2.27 11.48,2.7 11.48,3.3 11.23,3.55 11.23,7.23 11.75,7.74 11.75,8.41 v15.3,11.96 | 24.48,7.83 23.52,7.83 20.35,11 v19.11,11 | 24.48,7.83 25.17,8.52 25.17,14.69 v26.99,16.51 | v22.02,32.39 24.33,30.08 v26.68,30.08 | v9,29 9,27.15 8.79,26.95 8.79,26.21 10,25 10.24,25 13.25,21.99 13.25,21.25 12.39,20.39 12.39,19.93 10.93,18.48 9.35,18.48 8.87,18 v8,18 | v30,12 30,11.06 30.62,10.44 30.62,9.22 30.19,8.79 29.79,8.79 v29,8 28.83,7.83 24.48,7.83
+5V  (via drill 0.35)
  Top 0.254: v24,9 24,8.22 25.82,6.4 25.82,5.8 D1.A | v22.83,22.13 23.27,21.69 23.27,20.4 23.5,20.17 24.64,20.17 24.83,19.98 24.83,18.8 24.64,18.61 24.61,18.61 v24,18 | CN1.VBUS 19.79,33.8 20,33.6 20.16,33.6 20.32,33.44 20.32,33.27 20.79,32.79 | 20.79,32.79 20.89,32.69 | 21.25,32.25 v21.06,32.44 | 20.79,32.79 20.79,32.71 v21.06,32.44 | v21.06,32.44 21.31,32.19 21.31,32.1 21.5,31.91 IC1.7
  Bottom 0.254: v24,9 v24,18 | v22.83,22.13 22.18,22.77 22.18,23.09 21.77,23.5 21.46,23.5 21.06,23.9 v21.06,32.44
A1_RIGHTBUTTON  (via drill 0.39, 0.4)
  Top 0.15: IC1.37 27.67,26.68 27.83,26.84 28.27,26.84 28.66,27.23 28.66,27.58 v28.99,27.91
  Top 0.254: SW2.A' SW2.A | 33.23,18.64 SW2.A | R13.2 32.88,21 | R13.2 31.5,21.83 v31.5,22 | SW2.A 32.61,18.73 R13.2
  Bottom 0.254: v31.5,22 31.5,22.2 29.11,24.59 29.11,27.79 v28.99,27.91
A4_SOUND_SENSE  (via drill 0.4)
  Top 0.254: 27.51,13.24 v27.51,13.43 28,12.94 28,12.02 IC2.1 26.73,12.02 R9.1 | IC1.40 25.52,28.14 26.01,28.14 26.07,28.07 26.2,27.95 26.2,27.93 26.68,27.46 v27,27.46
  Bottom 0.254: v27.51,13.43 27,13.94 27,15.52 31.24,19.76 31.24,20.37 30.61,21 29,21 27,23 v27,27.46
CONN_LED
  Top 0.254: U2.39 13.49,17.28 14.27,18.07 R12.1
D0/RX  (via drill 0.39, 0.4)
  Top 0.254: IC1.20 17.71,26.18 16.67,25.14 16.67,24.64 v16.41,24.38 16.43,24.36 R15.6 | v13,6 13.59,6 R18.2
  Bottom 0.254: v13,6 13,6.77 16.73,10.5 16.73,15.6 16.83,15.7 16.83,16.3 16.73,16.4 16.73,24.06 v16.41,24.38
D1/TX  (via drill 0.39, 0.4)
  Top 0.254: IC1.21 17.97,25.68 17.68,25.4 v17.68,24.38 17.33,24.03 R15.5 | v19,16 17.46,16 15.73,14.27 15.73,13.67 15.3,13.24 14.7,13.24 R17.2
  Bottom 0.254: v17.68,24.38 17.68,21.27 17.5,21.09 17.5,17.5 v19,16
D2_SDA  (via drill 0.35)
  Top 0.254: IC1.19 17.44,26.68 15.63,24.87 R15.7 15.63,22.58 15.4,22.35 13.49,22.35 13.49,24.49 v14,25
  Bottom 0.254: v14,25 14.71,25.71 16.95,25.71 18,26.75 TP9.P$1
D3_SCL  (via drill 0.39)
  Top 0.254: IC1.18 17.18,27.18 16.16,26.16 15.14,26.16 15.02,26.03 15.02,25 | R15.8 14.73,23.59 15.02,23.87 15.02,25 | 15.02,25 13.59,26.43 v13.55,26.43
  Bottom 0.254: TP8.P$1 13.91,26.79 v13.55,26.43
D6  (via drill 0.35)
  Top 0.254: R22.7 28.12,21 28.12,20.62 28,20.49 v28,20.14 | 21.54,24.17 IC1.27 21.48,24.18 v21.48,22.79 | v21.48,22.79 21.42,22.73 | v12.81,25.79 12.76,25.79 12.36,26.19 9.96,26.19 v9.5,26.65 | v21.48,22.79 21.48,21.27 v21.32,21.11
  Bottom 0.254: v12.81,25.79 12.81,25.44 13.25,25 13.25,24.57 14.29,23.53 14.53,23.53 16.11,25.11 18.79,25.11 21.11,22.79 v21.48,22.79 | 10.25,27.61 10.32,27.68 | 10.32,27.68 10.46,27.81 10.46,30.54 9.71,31.29 9.71,31.3 8.43,32.58 NEOPIXEL-L.3 | 10.32,27.68 10.32,27.47 v9.5,26.65 | v21.32,21.11 22,21.11 | 22,21.11 22.14,21.11 | v28,20.14 26.88,21.26 25.56,21.26 25.26,20.96 22.15,20.96 22,21.11
D7_LISINT  (via drill 0.35, 0.39)
  Top 0.254: IC4.11 22,14.1 22.21,14.1 22.24,14.07 23.43,14.07 24.92,15.56 27.69,15.56 28,15.87 28.94,15.87 28.94,15.89 v31.95,15.89 | IC1.1 24.84,31.16 25,31 v25.25,31 | v28,27.5 28,28.35 29.14,29.49 29.14,30.09 29,30.23 v29,31.75
  Bottom 0.254: v31.95,15.89 31.7,16.15 31.7,20.56 28,24.25 v28,27.5 | v29,31.75 28.19,31.75 27.94,31.5 25.75,31.5 v25.25,31
D8  (via drill 0.39)
  Top 0.254: 19.46,14.35 v19.84,14.73 | IC4.8 20.61,15.5 v19.84,14.73 | IC1.28 22,23.27 22.18,23.09 22.18,22.5 22,22.31 22,21.71 22.13,21.59 22.13,20.92 22,20.79 v22,19.81 | v19.84,14.73 18.81,13.7 R6.2
  Bottom 0.254: v19.84,14.73 19.84,14.86 20.98,16 20.98,16.84 21.51,17.37 21.51,19.32 v22,19.81
D9  (via drill 0.35, 0.39)
  Top 0.254: R22.8 30.45,20.06 v30.51,20.06 30.51,21.95 30.77,22.21 30.77,22.3 30.98,22.52 30.98,24.9 30.51,25.38 30.51,29.97 NEOPIXEL-R.2 | IC1.29 22.54,24.17 22.54,23.53 25.98,20.09 v26.04,20.09
  Bottom 0.254: 30.26,20.06 v30.51,20.06 30.48,20.09 28.96,20.09 28.3,19.43 26.71,19.43 v26.04,20.09
D10
  Top 0.254: IC1.30 23.05,24.16 23.05,23.67 23.71,23.01 24.34,23.01 24.61,22.74 24.61,22.1 25.47,21.25 R22.5
D12  (via drill 0.35, 0.4)
  Top 0.254: R22.6 27.57,20.71 v27,20.14 | IC1.26 20.95,24.16 20.95,23.67 20.25,22.97 20.25,22.5 v20,22.25 | 12.45,4.97 v12.52,5.05 12.52,3.79 R16.2
  Bottom 0.254: v12.52,5.05 12.74,5.27 13.3,5.27 17.19,9.15 17.19,10.31 20,13.13 | v27,20.14 26.33,20.8 25.75,20.8 23.29,18.35 23.29,16.42 20,13.13 | v20,22.25 20,19.5 20.53,18.97 20.53,18.68 21.06,18.15 21.06,17.56 20.53,17.03 20.53,16.45 20.04,15.96 19.11,15.03 19.11,14.43 20,13.54 20,13.13
D13  (via drill 0.39)
  Top 0.254: R5.1 26.99,31.21 v28.41,29.79 | IC1.32 24.04,24.17 24.04,23.67 24.24,23.48 24.76,23.48 24.91,23.63 v25.3,23.63
  Bottom 0.254: 28.41,29.54 v28.41,29.79 28.13,29.52 28.13,29.13 27.29,28.29 26.8,28.29 26.52,28.01 26.27,28.01 26.27,24.6 v25.3,23.63
D+
  Top 0.254: CN1.D+ 18.12,33.92 18.12,34.61 18.31,34.81 19.15,34.81 20.02,35.68 20.02,37.86 20.21,38.06 22.99,38.06 23.02,38.02 23.18,37.86 24.27,36.77 R2.1
D-  (via drill 0.35, 0.4)
  Top 0.254: R1.1 28.62,33.87 v28.81,33.67 | CN1.D- 18.65,32.86 v18.32,32.53
  Bottom 0.254: v18.32,32.53 19.46,33.67 19.46,34.03 19.22,34.27 19.22,37.06 20.21,38.06 22.99,38.06 27.37,33.67 v28.81,33.67
DFU  (via drill 0.35)
  Top 0.254: RESET1.B RESET1.B' | R4.2 8.53,4.34 RESET1.B' | U2.24 11.25,7.83 v10.79,8.29 | v7,5 8.93,5 RESET1.B'
  Bottom 0.254: v7,5 8,5 8,6.35 6.27,8.09 6.27,8.8 6.7,9.23 7.3,9.23 8.25,8.29 v10.79,8.29
FCTRYRST_3V  (via drill 0.4)
  Top 0.254: U2.34 14.81,13.78 v15,13.97
  Bottom 0.254: v15,13.97 10.94,13.97 TP7.P$1
GND  (via drill 0.35, 0.39)
  Top 0.15: CN1.SPRT@1 21.93,33.05 22.29,33.05 22.68,32.66 22.68,32.12 22.5,31.94 22.5,31 | v27,29 26.58,29.42 26.16,29.42 25.89,29.68 25.82,29.68 | RESET1.A 11.2,0.77 11.33,0.64 13.06,0.64 13.22,0.8 13.22,2.05 14,2.83 | C6.2 34.82,9.03 R10.2 | IC1.43 25.42,29.74 | 29.94,24.94 29.39,25.48 29.39,26.25 29.23,26.41 27.9,26.41 27.17,25.68 IC1.35
  Top 0.203: C2.2 13.84,29.08 14,29.08 | 7.79,27 v7.2,27 | IC1.15 21.68,28.68 v22,29 19.5,26.5 IC1.23
  Top 0.254: 11.82,36.23 arc-90 PWR.C 14.23,36.64 CN1.SPRT@4 | 14.82,33.55 arc90 CN1.SPRT@2 14.4,33.98 CN1.SPRT@4 | 16.7,34.3 CN1.GND 16.34,33.8 16,33.47 | IC1.35 26.29,25.68 26.45,25.52 | IC4.10 21.5,16.5 21,17 IC4.5 20.25,18.11 | Y1.2 14.63,29.08 14,29.08 | IC4.10 21.5,13.65 22.07,13.07 C3.2 | 29.96,9.52 v29.89,9.52 | 15.81,10.58 16,10.4 | U2.13 3.69,6.41 3.69,5.49 3.88,5.3 5.31,5.3 5.5,5.49 5.5,6.41 U2.16 5.79,6.7 5.79,8.33 7.19,9.73 12.71,9.73 | D3.C 5.34,25.26 arc90 C11.2 5,26.11 v5,27 | U1.3 29.96,8.68 29.96,9.52 | IC2.4 29.41,10.07 29.96,9.52 | 34.99,13.04 C6.2 | RESET1.A' 11.09,5.3 11.61,5.3 11.94,5.64 U2.25 12.6,7.21 12.6,7.38 | U2.28 12.71,9.73 | 12.71,9.73 13.63,9.73 14.13,10.23 14.91,10.23 15.08,10.4 15.31,10.4 | C10.2 2.76,18.68 U2.2 U2.1 | U2.1 1.44,19.38 1,19.82 | 13,19.24 12.71,19.24 U2.42 | RESET.B' RESET.B | IC4.12 22.46,14.69 22.46,15.04 22.26,15.23 21.74,15.23 21.54,15.04 21.54,14.69 IC4.10 | IC1.23 19.03,23.74 19.03,23.34 18.71,23.02 18.71,21 18.51,20.8 v18.2,20.8 | 12.35,27.59 C2.2 12.69,27.69 12,27 10.16,27 9.79,27.36 9.21,27.36 8.85,27 | R13.1 32,23.03 v32,24 | 9.79,25 D4.C | 9.79,25 10.22,25 10.89,24.33 11.67,24.33 12.58,23.42 12.58,21.86 13,21.44 12,20.44 12,20.22 | IC1.33 24.85,24.21 25,24.36 25.6,24.36 26.03,23.93 26.03,23.83 28.83,23.83 29.94,24.94 v29.95,24.94 | NEOPIXEL-L.4 4.29,35.12 5.24,34.17 5.83,34.17 v9,31 | 22.55,30.95 22.5,31 | U2.1 3.3,19 4,19 4.35,19 4.52,19.17 6.64,19.17 | v8,19 7.2,19 7.03,19.17 6.83,19.17 | v11.68,20.22 12,20.22 | 12,20.22 12.22,20.22 | 22.54,31.2 IC1.5 22.5,31 | 25.82,29.68 IC1.43 | CN1.BASE@1 CN1.BASE@2 14.5,36.58 CN1.SPRT@4 | CN1.SPRT@3 21.6,33.98 CN1.SPRT@1
  Top 0.254: L.C 28.31,36.9 29.24,37.83 30.76,37.83 31.83,36.76 31.83,36.17 NEOPIXEL-R.1 | 9.79,25 9.2,25 8.47,25.73 8.47,26.4 8.28,26.59 7.61,26.59 v7.2,27 | 22.5,31 22.5,30.36 | 22.5,30.36 22.41,30.36 | v22,29 22.5,29 22.5,30.36
  Top 0.61: 15.31,10.4 16,10.4 16.92,10.4 17.3,10.02 U3.2 | 24.92,4.55 v23.4,6.08 22.24,7.24 BATT.1 | U1.3 U1.2 32.49,7.07
  Top 1.016: 14,2.83 C5.2 | NEOPIXEL-L.4 3.75,35.12 5.08,33.79 7,33.79 9.19,31.59 10.38,31.59 | BATT.1 22.36,7.62 C8.2 22.07,11.79 22.07,13.07 | RESET.B' 14.8,33.58 CN1.SPRT@2 14.82,33.8 15.25,33.8 15.59,33.47 16,33.47 16.44,33.47
  Bottom 0.254: 27.21,12.7 27.72,12.7 29.89,10.52 v29.89,9.52 | v18.2,20.8 18.2,19.72 18.67,19.25 18.67,18.76 19.1,18.33 19.87,18.33 v20.35,17.85 | v7.2,27 v5,27 v9,31 | v29.95,24.94 30.08,24.94 31.06,24.94 v32,24 | 28.59,31 30,31 30.77,31 | v8,19 10.45,19 v11.68,20.22
  Bottom 0.406: v27,29 27.6,29.6 27.6,30.12 28.44,30.96 29.32,30.96 29.36,31 30,31
  Bottom 1.016: NEOPIXEL-R.1 30.77,32.77 30.77,31 30.77,26.37 30.08,25.68 30.08,24.94 | v29.95,24.94 30.88,24 v32,24 | NEOPIXEL-L.4 4.44,33.68 CN1.SPRT@2
  other vias: 13.9,28.98
  pour Bottom (no thermals): 0.33,38.9 0.2,32.17 36.03,32.17 36.16,38.9
  pour Top (rank 2, no thermals): -1,39 -1,0 37,0 37,39
  pour Bottom (isolate 0.5): 9,33 9,5 31,5 31,33
MISO  (via drill 0.39)
  Top 0.254: IC4.7 20.09,16 19.21,16.89 16.99,16.89 v16.1,16 | IC1.11 17.29,31.16 v16.94,31.51
  Bottom 0.254: v16.94,31.51 16.49,31.51 16.29,31.71 15.71,31.71 14.78,30.78 TP1.P$1 14.38,30.49 11.64,27.76 11.64,24.89 15,21.53 15,17 15.27,16.73 15.3,16.73 16.04,16 v16.1,16
MODE  (via drill 0.4)
  Top 0.254: U2.18 7,6.6 v7,8.5 | R16.1 12.18,1.57 v10.75,3
  Bottom 0.254: v10.75,3 10.75,4.25 7,8 v7,8.5
MODE_LED
  Top 0.254: R7.1 2.46,19.94 8.18,19.94 11.53,16.58 U2.38
MOSI  (via drill 0.35, 0.39)
  Top 0.254: v17,32.49 17.42,32.08 17.73,32.08 18.01,31.8 18.62,31.8 18.71,31.89 19.76,31.89 19.95,31.7 19.95,31.2 IC1.10 | v14.25,16.75 16.1,16.75 16.7,17.35 19.39,17.35 20.24,16.5 IC4.6
  Bottom 0.254: v14.25,16.75 14,17 14.54,17.54 14.54,21.34 11.05,24.84 11.05,29.91 TP4.P$1 12.85,30.78 14.31,32.24 16.75,32.24 v17,32.49
N$1
  Top 0.254: 11.74,34.21 arc90 PWR.A 11.65,33.22 R3.1
N$2
  Top 0.254: IC2.2 27.24,11.2 26.68,11.2 26.65,11.17 R8.2 24.53,12.7 R9.2
N$3  (via drill 0.35)
  Top 0.254: IC1.3 23.55,31.2 23.55,31.7 23.81,31.96 v25.05,31.96 | v29.68,32.54 29.32,32.54 29.13,32.73 28.24,32.73 R1.2
  Bottom 0.254: v29.68,32.54 29.32,32.54 29.13,32.73 28.52,32.73 27.75,31.96 v25.05,31.96
N$4
  Top 0.254: IC1.4 23,31.85 23.82,32.67 23.82,33.1 R2.2
N$5
  Top 0.254: 1.35,24.68 R7.2 1.35,24.78 D3.A
N$6
  Top 0.254: C9.1 R10.1 32.81,9.8 R11.2 33.08,10.07 IC2.5 31.64,8.82 C9.1
N$7
  Top 0.254: 20.09,6.46 20.09,7.13 BATT.2
  Top 0.61: 20.09,6.46 18.32,4.68 17.01,4.68 16.28,3.95 16.28,3.07 D2.A
N$8
  Top 0.254: IC1.17 16.92,27.68 16.1,26.87 15.2,26.87 14.72,27.34 Y1.1
N$9
  Top 0.254: IC1.16 18.52,28.19 17.3,28.19 16.45,29.04 Y1.3
N$10
  Top 0.254: R5.2 26.22,33.05 L.A
N$11
  Top 0.254: D4.A 13.03,23.85 13.03,22.05 14.5,20.59 R12.2
N$12  (via drill 0.35)
  Top 0.254: U2.9 3.06,10.43 3.98,10.43 6,12.45 v6,17
  Bottom 0.254: Y2.1 6.68,17.68 v6,17
N$13  (via drill 0.35)
  Top 0.254: U2.10 3.06,9.73 3.98,9.73 6.71,12.45 6.71,17.29 6.29,17.71 v5.29,17.71 v5.3,17.7
  Bottom 0.254: v5.3,17.7 5.3,17.92 Y2.2
N$14  (via drill 2)
  other vias: 6,36
N$15
  Top 0.254: 27.33,8.98 C1.2 24.36,11.08 R8.1
N$16  (via drill 2)
  other vias: 30,36
N$17  (via drill 2)
  other vias: 30,2
N$18
  pour Top: 2.75,24.5 2.75,21 12.75,21 12.75,24.5
RST  (via drill 0.35)
  Top 0.254: 15,29.89 RESET.A' RESET.A | 15,29.89 15.55,29.89 15.88,30.22 17.5,30.22 17.99,29.73 18.48,29.73 IC1.13 | v16,31 15,30 15,29.89
  Bottom 0.254: TP3.P$1 16.26,30.74 v16,31
RXI
  Top 0.254: U2.29 12.71,10.43 13.63,10.43 13.82,10.62 13.82,10.66 R17.1
SCK  (via drill 0.35, 0.39)
  Top 0.254: IC1.9 20.5,32 v19.87,32.63 | v16,18.5 18.93,18.5 19.1,18.33 19.83,18.33 20.05,18.56 21.13,18.56 21.5,18.19 IC4.4
  Bottom 0.254: v16,18.5 16,21.18 12.1,25.08 12.1,26.08 13.88,27.87 17.05,27.87 TP2.P$1 19.96,32.54 v19.87,32.63
SOUNDOUT
  Top 0.254: C1.1 28.24,7.28 U1.1
SWCLK  (via drill 0.4)
  Top 0.254: U2.36 14.18,15.18 v15,16
  Bottom 0.254: TP5.P$1 11.19,16 v15,16
SWDIO/RST_3V  (via drill 0.4)
  Top 0.254: U2.35 12.71,14.63 14.27,14.63 14.63,14.98 v15.02,14.98
  Bottom 0.254: v15.02,14.98 14.73,15.27 9.95,15.27 TP6.P$1
TXLED  (via drill 0.35, 0.39)
  Top 0.254: R22.1 R22.2 R22.3 R22.4 26.45,22.95 v25.82,22.32 | IC1.22 18.57,25.14 18.57,23.75 17.94,23.11 17.94,21.85 17.58,21.5 R15.4 R15.3 16.18,21.5 | 16.18,21.5 R15.2 R15.1 | 16.18,21.5 18.61,19.06 v19.4,19.06
  Bottom 0.254: v19.4,19.06 19.29,19.17 19.29,22.54 19.71,22.96 20.29,22.96 20.71,22.54 20.71,22.33 21.23,21.82 22.08,21.82 22.43,21.47 22.52,21.42 24.92,21.42 v25.82,22.32
TXO
  Top 0.254: 15.27,8.88 15,8.88 | 15,8.88 U2.27 | 15,8.88 15,9.11 R18.1
VCC  (via drill 0.39, 0.5)
  Top 0.61: 16.35,8 16.35,7.73 v17.55,7.73 18.25,7.73 U3.3 | 16.35,8 U3.1 | 16.35,8 16.19,7.84 16.19,6.83 15.52,6.17 D2.C 14.16,4.66 C5.1
  Top 0.813: C4.1 28.27,3.92 D1.C 27.54,1 27.64,1
  Top 1.016: 27.64,1 v27.75,1
  Bottom 0.61: 31.46,3.66 32.54,4.75
  Bottom 1.27: v17.55,7.73 19.71,7.73 23.78,3.66
  pour Bottom (isolate 0.5, rank 2, no thermals): -2,31 -2,0 37,0 37,31
VCC/2
  Top 0.254: IC2.3 IC2.6 IC2.7

### Text on the board
tPlace: GND | GND | DI | DI | VCC | VCC
bPlace: CB-V1 | Class Demo